# Altium schematic sheet IDCI_WifiNode_CPU0.SchDoc: WifiNode_CPU0
size A4; Author: Luciano Lopez; CompanyName: UTN - FRBA; Revision: 1; SheetNumber: 3; SheetTotal: 5
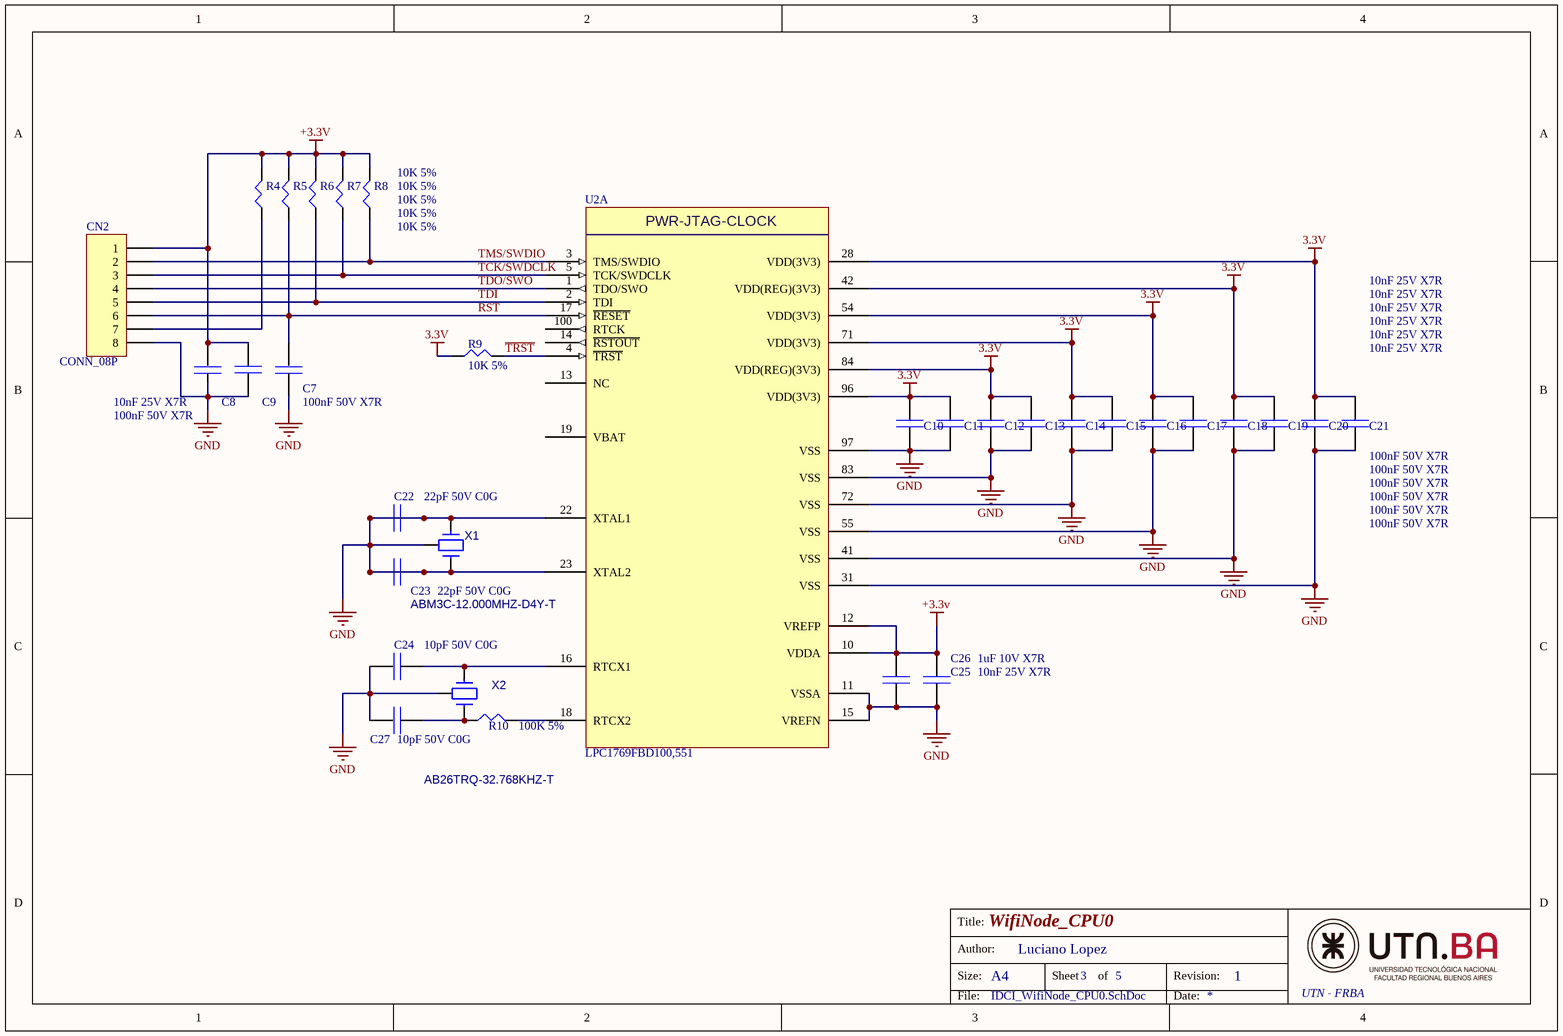
[diagram p0: IDCI_WifiNode_CPU0.SchDoc]

## Parts
C7  100nF 50V X7R  [C_0805]
C8  10nF 25V X7R  [C_0805]
C9  100nF 50V X7R  [C_0805]
C10  100nF 50V X7R  [C_0805]
C11  10nF 25V X7R  [C_0805]
C12  100nF 50V X7R  [C_0805]
C13  10nF 25V X7R  [C_0805]
C14  100nF 50V X7R  [C_0805]
C15  10nF 25V X7R  [C_0805]
C16  100nF 50V X7R  [C_0805]
C17  10nF 25V X7R  [C_0805]
C18  100nF 50V X7R  [C_0805]
C19  10nF 25V X7R  [C_0805]
C20  100nF 50V X7R  [C_0805]
C21  10nF 25V X7R  [C_0805]
C22  22pF 50V C0G  [C_0805]
C23  22pF 50V C0G  [C_0805]
C24  10pF 50V C0G  [C_0805]
C25  10nF 25V X7R  [C_0805]
C26  1uF 10V X7R  [C_0805]
C27  10pF 50V C0G  [C_0805]
CN2  CONN_08P  [HEADER_M_1x8_0.1"]
R4  10K 5%  [R_0805]
R5  10K 5%  [R_0805]
R6  10K 5%  [R_0805]
R7  10K 5%  [R_0805]
R8  10K 5%  [R_0805]
R9  10K 5%  [R_0805]
R10  100K 5%  [R_0805]
U2  LPC1769FBD100,551  [LQFP_100]  (part A of 4)
X1  ABM3C-12.000MHZ-D4Y-T
X2  AB26TRQ-32.768KHZ-T  [CRYSTA_32.768KHZ]

## Nets
3.3V: C10.2 C11.2 C12.2 C13.2 C14.2 C15.2 C16.2 C17.2 C18.2 C19.2 C20.2 C21.2 R9.1 U2.28(VDD(3V3)) U2.42(VDD(REG)(3V3)) U2.54(VDD(3V3)) U2.71(VDD(3V3)) U2.84(VDD(REG)(3V3)) U2.96(VDD(3V3))
+3.3V: C8.1 C9.2 C25.2 C26.2 CN2.1 R4.2 R5.2 R6.2 R7.2 R8.2 U2.10(VDDA) U2.12(VREFP)
GND: C7.2 C8.2 C9.1 C10.1 C11.1 C12.1 C13.1 C14.1 C15.1 C16.1 C17.1 C18.1 C19.1 C20.1 C21.1 C22.1 C22.2 C23.1 C23.2 C24.2 C25.1 C26.1 C27.2 CN2.8 U2.11(VSSA) U2.15(VREFN) U2.22(XTAL1) U2.23(XTAL2) U2.31(VSS) U2.41(VSS) U2.55(VSS) U2.72(VSS) U2.83(VSS) U2.97(VSS) X1.1 X1.2 X1.3 X2.2
~{TRST}: R9.2 U2.4(~{TRST})
RST: C7.1 CN2.6 R5.1 U2.17(~{RESET})
TCK/SWDCLK: CN2.3 R7.1 U2.5(TCK/SWDCLK)
TDI: CN2.5 R6.1 U2.2(TDI)
TDO/SWO: CN2.4 U2.1(TDO/SWO)
TMS/SWDIO: CN2.2 R8.1 U2.3(TMS/SWDIO)
NetC24_1: C24.1 U2.16(RTCX1) X2.3
NetC27_1: C27.1 R10.1 X2.1
NetCN2_7: CN2.7 R4.1
NetR10_2: R10.2 U2.18(RTCX2)

Not connected (* = marked no-connect by the designer): U2 13(NC) 14(~{RSTOUT}) 19(VBAT) 100(RTCK)

## Notes on the sheet
- Title:
- Size:
- Author:
- A4
- Sheet
- of
- Revision:
- File:
- Date:
- (in symbol LPC1769FBD100_Multipart, part A) PWR-JTAG-CLOCK

## Library data of the parts
C7-C27 = CAPACITOR: 100nF x 50v
CN2 = CONN_08P: Connector Generic 8 Vias
R4-R10 = Resistor
U2 = LPC1769FBD100_Multipart: Mcu Cortex M3 LQFP100
X1 X2 = CRYSTAL 3P: Crystal 2 Vias + GND